# Altium schematic sheet RTC.SchDoc
size Letter; Organization: Midnight Sun Solar Rayce Car Team; Address1: University of Waterloo; Address2: 200 University Ave W; Address3: Waterloo, ON, Canada; Address4: N2L 3E9; Website: www.uwmidsun.com
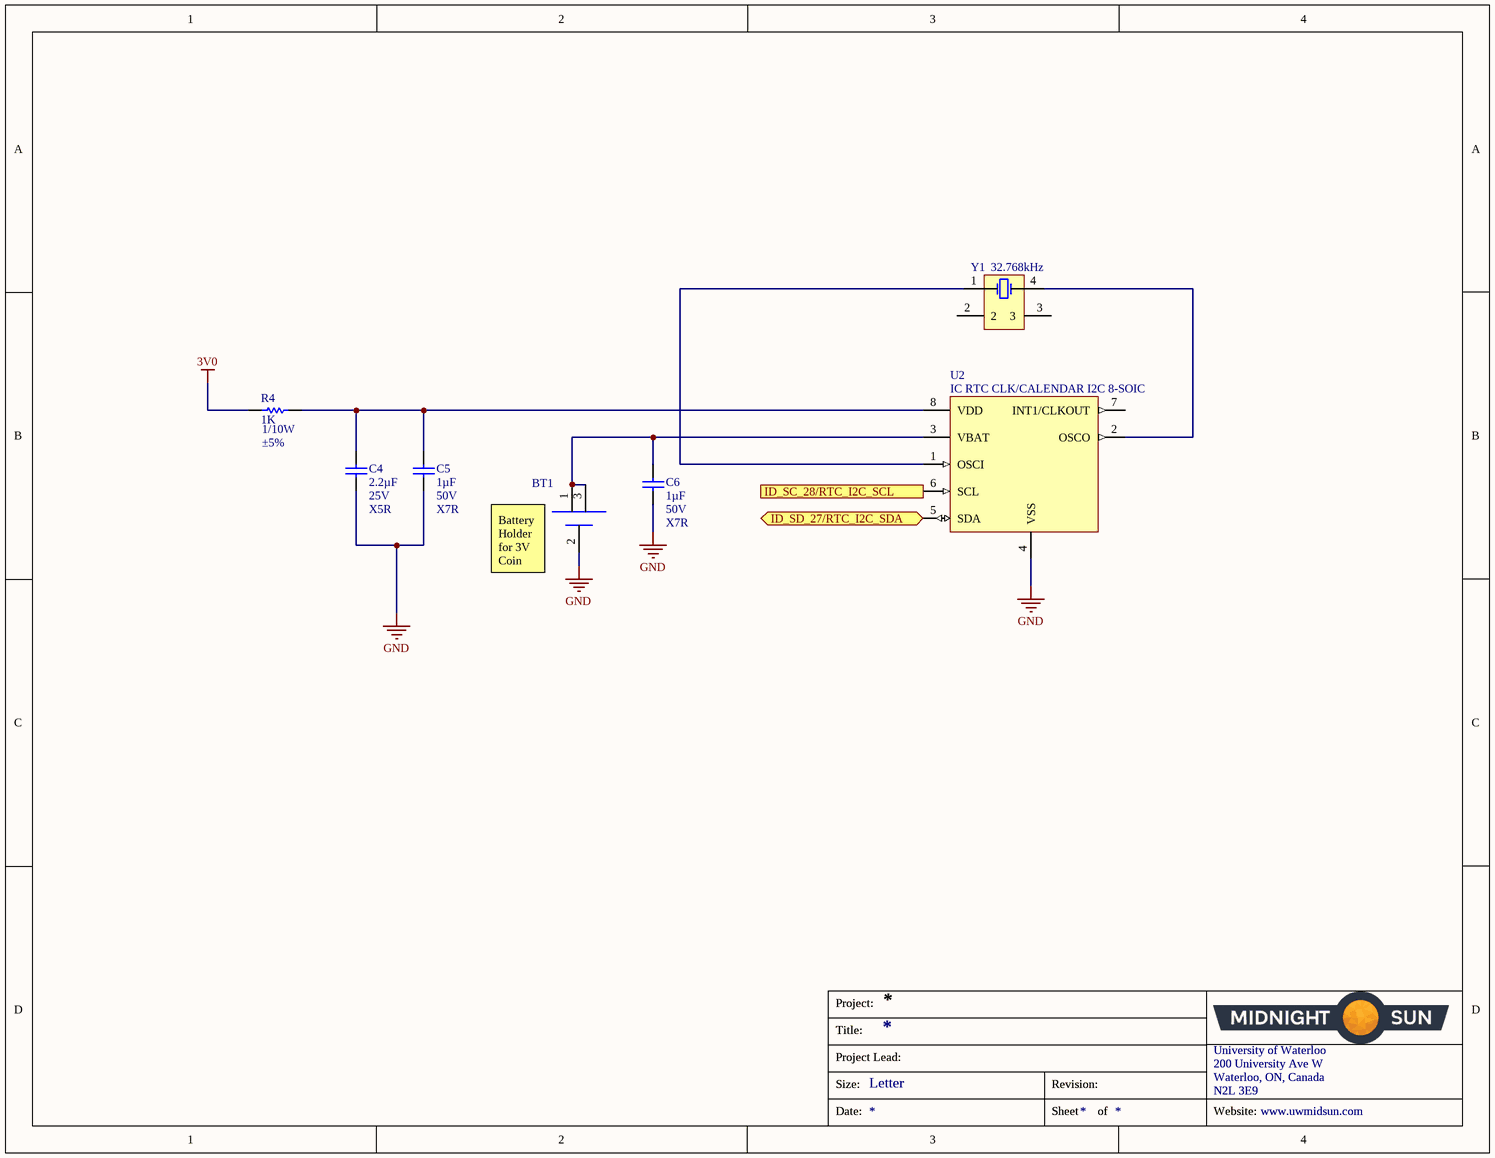
[diagram p0: RTC.SchDoc]

## Parts
BT1  HOLDER BATTERY COIN 12MM DIA  [HOLDER COIN CELL 1220 3V]  (value not drawn)
C4  Capacitance: 2.2µF  Voltage: 25V  Temperature Coefficient: X5R  [CAP, 0603]  (hidden comment: CAP CER 2.2UF 25V 10% X5R 0603)
C5  Capacitance: 1µF  Voltage: 50V  Temperature Coefficient: X7R  [CAP, 0603]  (hidden comment: CAP CER 1UF 50V 10% X7R 0603)
C6  Capacitance: 1µF  Voltage: 50V  Temperature Coefficient: X7R  [CAP, 0603]  (hidden comment: CAP CER 1UF 50V 10% X7R 0603)
R4  1K  Tolerance: ±5%  Power (Watts): 1/10W  [RES, 0603]
U2  IC RTC CLK/CALENDAR I2C 8-SOIC  [SOIC8]
Y1  Frequency: 32.768kHz  [4-SOJ]  (hidden comment: CRYSTAL 32.7680KHZ 12.5PF SMD)

## Ports
ID_SC_28/RTC_I2C_SCL (in), ID_SD_27/RTC_I2C_SDA (bidir)

## Nets
3V0: R4.1
GND: BT1.2(negative) C4.2 C5.2 C6.2 U2.4(VSS)
ID_SC_28/RTC_I2C_SCL: U2.6(SCL) ; port ID_SC_28/RTC_I2C_SCL
ID_SD_27/RTC_I2C_SDA: U2.5(SDA) ; port ID_SD_27/RTC_I2C_SDA
NetBT1_1: BT1.1(positive_1) BT1.3(positive_2) C6.1 U2.3(VBAT)
NetC4_1: C4.1 C5.1 R4.2 U2.8(VDD)
NetU2_1: U2.1(OSCI) Y1.1
NetU2_2: U2.2(OSCO) Y1.4

Not connected (* = marked no-connect by the designer): U2 7(INT1/CLKOUT); Y1 2 3

## Notes on the sheet
- (near BT1) Battery Holder for 3V Coin Cell
- Project:
- Title:
- Size:
- Project Lead:
- Letter
- Revision:
- University of Waterloo
- 200 University Ave W
- Waterloo, ON, Canada
- N2L 3E9
- Date:
- Sheet
- of
- Website:

## Library data of the parts
BT1 = HOLDER BATTERY COIN 12MM DIA: Coin cell holder smd; Manufacturer: Keystone Electronics; Manufacturer Part Number: 3000; Body Material: Bronze; Number of Batteries: 1; Supplier 1: Digi-Key; Stock 1: 17093; Pricing 1: 1=0.58, 10=0.545, 50=0.4356, 100=0.4175, 250=0.38116, 500=0.363, 1000=0.30495, 2500=0.27225, 5000=0.26318 (USD); Mount: Surface Mount,PCB; Contact Material: Bronze,Nickel; Material: Bronze; Contact Plating: Nickel; Package Quantity: 100; Packaging: Bulk; Termination: SMD/SMT; Number of Cells: 1; Diameter: 12mm; Height: 3.17mm; REACH SVHC: No SVHC; Lead Free: Lead Free; ComponentLink1URL: https://datasheet.ciiva.com/3/3000-3953.pdf; ComponentLink1Description: https://datasheet.ciiva.com/3/3000-3953.pdf; ComponentLink2URL: https://datasheet.ciiva.com/11714/0900766b8002ef78-11714721.pdf; ComponentLink2Description: https://datasheet.ciiva.com/11714/0900766b8002ef78-11714721.pdf; ComponentLink3URL: https://datasheet.ciiva.com/20221/18-3570e-20221596.pdf; ComponentLink3Description: https://datasheet.ciiva.com/20221/18-3570e-20221596.pdf; ComponentLink4URL: https://datasheet.ciiva.com/1391/1718262-1391630.pdf; ComponentLink4Description: https://datasheet.ciiva.com/1391/1718262-1391630.pdf; Supplier Part Number 1: 36-3000-ND
C4 = CAP CER 2.2UF 25V 10% X5R 0603: 2.2µF ±10% 25V Ceramic Capacitor X5R 0603 (1608 Metric); Manufacturer 1: Murata Electronics North America; Manufacturer Part Number 1: GRM188R61E225KA12D; Supplier 1: Digi-Key; Supplier Part Number 1: 490-10731-1-ND; Packaging: Cut Tape (CT); Part Status: Active; Operating Temperature: -55°C ~ 85°C; Ratings: -; Mounting Type: Surface Mount, MLCC; Package / Case: 0603 (1608 Metric); Size / Dimension: 0.063" L x 0.031" W (1.60mm x 0.80mm); Height - Seated (Max): -; Thickness (Max): 0.035" (0.90mm); Lead Spacing: -; Lead Style: -; ComponentLink1URL: http://www.murata.com/~/media/webrenewal/support/library/catalog/products/capacitor/mlcc/c02e.ashx; ComponentLink1Description: http://www.murata.com/~/media/webrenewal/support/library/catalog/products/capacitor/mlcc/c02e.ashx; Tolerance: ±10%
C5 C6 = CAP CER 1UF 50V 10% X7R 0603: 1µF ±10% 50V Ceramic Capacitor X7R 0603 (1608 Metric); Manufacturer 1: Taiyo Yuden; Manufacturer Part Number 1: UMK107AB7105KA-T; Supplier 1: Digi-Key; Supplier Part Number 1: 587-3247-1-ND; Packaging: Cut Tape (CT); Part Status: Active; Operating Temperature: -55°C ~ 125°C; Ratings: -; Mounting Type: Surface Mount, MLCC; Package / Case: 0603 (1608 Metric); Size / Dimension: 0.063" L x 0.031" W (1.60mm x 0.80mm); Height - Seated (Max): -; Thickness (Max): 0.037" (0.95mm); Lead Spacing: -; Lead Style: -; ComponentLink1URL: http://www.yuden.co.jp/productdata/catalog/en/mlcc_all_e.pdf; ComponentLink1Description: http://www.yuden.co.jp/productdata/catalog/en/mlcc_all_e.pdf; Tolerance: ±10%
R4 = RES 1K OHM 5% 1/10W 0603: 1k Ohm ±5% 0.1W, 1/10W Chip Resistor 0603 (1608 Metric); Manufacturer: Yageo; Manufacturer Part Number: RC0603JR-071KL; Temperature Coefficient: ±100ppm/°C; Supplier 1: Digi-Key; Supplier Part Number 1: 311-1.0KGRCT-ND; RoHS: RoHS Compliant; Category: Resistors; Stock 1: 4415240; Pricing 1: 1=0.15, 10=0.017, 100=0.0071, 1000=0.0032, 2500=0.00278 (CAD); Packaging: Cut Tape (CT); Part Status: Active; Resistance (Ohms): 1k; Composition: Thick Film; Features: Moisture Resistant; Operating Temperature: -55°C ~ 155°C; Package / Case: 0603 (1608 Metric); Supplier Device Package: 0603; Size / Dimension: 0.063" L x 0.031" W (1.60mm x 0.80mm); Height - Seated (Max): 0.022" (0.55mm); Failure Rate: -; ComponentLink1URL: http://www.yageo.com/documents/recent/PYu-RC_Group_51_RoHS_L_7.pdf; ComponentLink1Description: http://www.yageo.com/documents/recent/PYu-RC_Group_51_RoHS_L_7.pdf
U2 = IC RTC CLK/CALENDAR I2C 8-SOIC: Real Time Clock (RTC) IC Clock/Calendar I²C, 2-Wire Serial 8-SOIC (0.154", 3.90mm Width); Manufacturer: NXP Semiconductors; Manufacturer Part Number: PCF8523T/1,118; Min Supply Voltage: 1.2V; Max Supply Voltage: 5.5V; Time Format: HH:MM:SS; Supplier 1: Digi-Key; Stock 1: 18252; Pricing 1: 1=1.3, 10=1.16, 100=0.9045, 500=0.74718, 1000=0.58988 (USD); Mount: Surface Mount; Case/Package: SO; Number of Pins: 8; Contact Plating: Gold; Min Operating Temperature: -40°C; Max Operating Temperature: 85°C; Packaging: Tape and Reel; Interface: I2C; Package Quantity: 2500; Logic Function: Clock; Radiation Hardening: No; REACH SVHC: No SVHC; Lead Free: Lead Free; ComponentLink1URL: https://datasheet.ciiva.com/15152/getdatasheetpartid-445247-15152839.pdf; ComponentLink1Description: https://datasheet.ciiva.com/15152/getdatasheetpartid-445247-15152839.pdf; ComponentLink2URL: https://datasheet.ciiva.com/1238/pcf8523-1238780.pdf; ComponentLink2Description: https://datasheet.ciiva.com/1238/pcf8523-1238780.pdf; ComponentLink3URL: https://datasheet.ciiva.com/1238/pcf8523-1238781.pdf; ComponentLink3Description: https://datasheet.ciiva.com/1238/pcf8523-1238781.pdf; ComponentLink4URL: https://datasheet.ciiva.com/16286/pcf8523-16286477.pdf; ComponentLink4Description: https://datasheet.ciiva.com/16286/pcf8523-16286477.pdf; ComponentLink5URL: https://datasheet.ciiva.com/1238/pcf8523-1238782.pdf; ComponentLink5Description: https://datasheet.ciiva.com/1238/pcf8523-1238782.pdf; Supplier Part Number 1: 568-5306-1-ND
Y1 = CRYSTAL 32.7680KHZ 12.5PF SMD: 32.768kHz ±20ppm Crystal 12.5pF 50 kOhms 4-SOJ, 5.50mm pitch; Manufacturer: ECS International; Manufacturer Part Number: ECS-.327-12.5-17X-TR; ESR (Equivalent Series Resistance): 50kR; Supplier 1: Digi-Key; Stock 1: 67622; Pricing 1: 1=0.56, 10=0.468, 50=0.4208, 100=0.374, 500=0.3553, 1000=0.2992 (USD); Mount: Surface Mount; Min Operating Temperature: -40°C; Max Operating Temperature: 85°C; Package Quantity: 1; Frequency Tolerance: 20ppm; Load Capacitance: 12.5pF; Packaging: Tape and Reel; Tolerance: 20ppm; Termination: SMD/SMT; Length: 0.315inch; Height: 0.098inch; Width: 0.15inch; Lead Free: Lead Free; ComponentLink1URL: https://datasheet.ciiva.com/852/ecx-306x-852775.pdf; ComponentLink1Description: https://datasheet.ciiva.com/852/ecx-306x-852775.pdf; ComponentLink2URL: https://datasheet.ciiva.com/852/ecx-306x-852776.pdf; ComponentLink2Description: https://datasheet.ciiva.com/852/ecx-306x-852776.pdf; ComponentLink3URL: https://datasheet.ciiva.com/852/ecx-306x-852777.pdf; ComponentLink3Description: https://datasheet.ciiva.com/852/ecx-306x-852777.pdf; Supplier Part Number 1: XC1195CT-ND